# Altium project TripleCam.PrjPcb
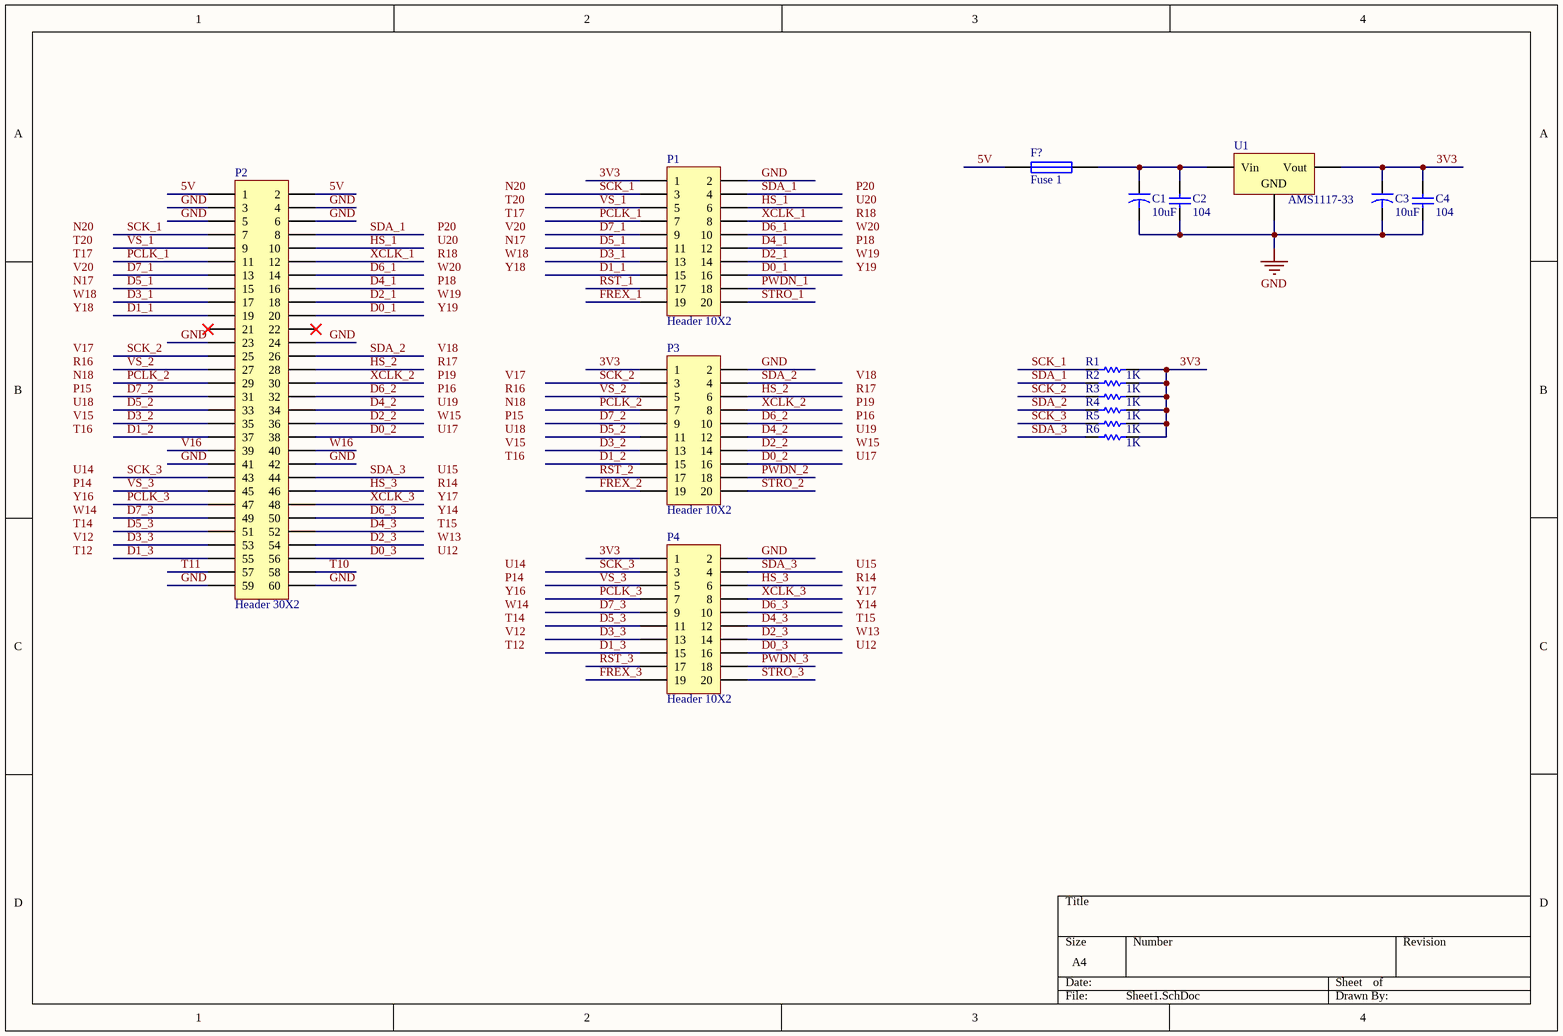
[diagram p0: Sheet1.SchDoc]
1 sheet, 16 parts. Net scope: global (net labels, ports and power ports of the same name join across sheets).
Board file: PCB1.PcbDoc

## Sheet Sheet1.SchDoc
size A4

### Parts
C1  value 10uF  [R0805]  (hidden comment: Cap2)
C2  value 104  [R0805]  (hidden comment: Cap)
C3  value 10uF  [R0805]  (hidden comment: Cap2)
C4  value 104  [R0805]  (hidden comment: Cap)
F1  Fuse 1  [R1206]
P1  Header 10X2  [PCBComponent_1]
P2  Header 30X2  [BTBCON_0.8mm_60P]
P3  Header 10X2  [PCBComponent_1]
P4  Header 10X2  [PCBComponent_1]
R1  value 1K  [R0805]  (hidden comment: Res1)
R2  value 1K  [R0805]  (hidden comment: Res1)
R3  value 1K  [R0805]  (hidden comment: Res1)
R4  value 1K  [R0805]  (hidden comment: Res1)
R5  value 1K  [R0805]  (hidden comment: Res1)
R6  value 1K  [R0805]  (hidden comment: Res1)
U1  AMS1117-33  [SOT-223   AMS1117]

### Nets
GND: C1.2 C2.1 C3.2 C4.1 P1.2 P2.3 P2.4 P2.5 P2.6 P2.23 P2.24 P2.41 P2.42 P2.59 P2.60 P3.2 P4.2 U1.1(GND)
3V3: C3.1 C4.2 P1.1 P3.1 P4.1 R1.1 R2.1 R3.1 R4.1 R5.1 R6.1 U1.2(Vout)
5V: F1.1 P2.1 P2.2
D0_1: P1.16 P2.20
D0_2: P2.38 P3.16
D0_3: P2.56 P4.16
D1_1: P1.15 P2.19
D1_2: P2.37 P3.15
D1_3: P2.55 P4.15
D2_1: P1.14 P2.18
D2_2: P2.36 P3.14
D2_3: P2.54 P4.14
D3_1: P1.13 P2.17
D3_2: P2.35 P3.13
D3_3: P2.53 P4.13
D4_1: P1.12 P2.16
D4_2: P2.34 P3.12
D4_3: P2.52 P4.12
D5_1: P1.11 P2.15
D5_2: P2.33 P3.11
D5_3: P2.51 P4.11
D6_1: P1.10 P2.14
D6_2: P2.32 P3.10
D6_3: P2.50 P4.10
D7_1: P1.9 P2.13
D7_2: P2.31 P3.9
D7_3: P2.49 P4.9
FREX_1: P1.19
FREX_2: P3.19
FREX_3: P4.19
HS_1: P1.6 P2.10
HS_2: P2.28 P3.6
HS_3: P2.46 P4.6
PCLK_1: P1.7 P2.11
PCLK_2: P2.29 P3.7
PCLK_3: P2.47 P4.7
PWDN_1: P1.18
PWDN_2: P3.18
PWDN_3: P4.18
RST_1: P1.17
RST_2: P3.17
RST_3: P4.17
SCK_1: P1.3 P2.7 R1.2
SCK_2: P2.25 P3.3 R3.2
SCK_3: P2.43 P4.3 R5.2
SDA_1: P1.4 P2.8 R2.2
SDA_2: P2.26 P3.4 R4.2
SDA_3: P2.44 P4.4 R6.2
STRO_1: P1.20
STRO_2: P3.20
STRO_3: P4.20
T10: P2.58
T11: P2.57
V16: P2.39
VS_1: P1.5 P2.9
VS_2: P2.27 P3.5
VS_3: P2.45 P4.5
W16: P2.40
XCLK_1: P1.8 P2.12
XCLK_2: P2.30 P3.8
XCLK_3: P2.48 P4.8
NetC1_1: C1.1 C2.2 F1.2 U1.3(Vin)

Not connected (* = marked no-connect by the designer): P2 21* 22*

### Notes on the sheet
- Labels drawn without touching a wire or pin: N17, N18, N20, P14, P15, P16, P18, P19, P20, R14, R16, R17, R18, T12, T14, T15, T16, T17, T20, U12, U14, U15, U17, U18, U19, U20, V12, V15, V17, V18, V20, W13, W14, W15, W18, W19, W20, Y14, Y16, Y17, Y18, Y19

### Library data of the parts
C1 C3 = Cap2: Capacitor; Published: 23-Sep-2002; PackageReference: CAPR5-4X5; Publisher: Altium Limited; PackageDescription: Capacitor; 2 Leads
C2 C4 = Cap: Capacitor; Published: 8-Jun-2000; LatestRevisionDate: 17-Jul-2002; LatestRevisionNote: Re-released for DXP Platform.; PackageReference: RAD-0.3; Publisher: Altium Limited; PackageDescription: Radial Cap, Thru-Hole; 2 Leads; 0.3 in Pin Spacing
F1 = Fuse 1: Fuse; Published: 8-Jun-2000; LatestRevisionDate: 17-Jul-2002; LatestRevisionNote: Re-released for DXP Platform.; PackageReference: PIN-W2/E2.8; Publisher: Altium Limited; PackageDescription: Thru-Hole; 2 Leads
P1 P3 P4 = Header 10X2: Header, 10-Pin, Dual row; LatestRevisionDate: 17-Jul-2002; LatestRevisionNote: Re-released for DXP Platform.; Publisher: Altium Limited
P2 = Header 30X2: Header, 30-Pin, Dual row; LatestRevisionDate: 17-Jul-2002; LatestRevisionNote: Re-released for DXP Platform.; Publisher: Altium Limited
R1-R6 = Res1: Resistor; Published: 8-Jun-2000; LatestRevisionDate: 17-Jul-2002; LatestRevisionNote: Re-released for DXP Platform.; PackageReference: AXIAL-0.3; Publisher: Altium Limited; PackageDescription: Axial Device, Thru-Hole; 2 Leads; 0.3 in Pin Spacing
U1 = Volt Reg: Voltage Regulator; Published: 24-Mar-1999; LatestRevisionDate: 29-May-2009; LatestRevisionNote: IPC-7351 Footprint Added.; PackageReference: D2PAK; Publisher: Altium Limited; PackageDescription: 3-Pin Transistor Outline Package 2.54 mm Pitch, 15.1 mm Lead Span